# Altium schematic sheet FDDplus3.SchDoc
size A2; Organization: HOME; Address1: L3, 12a Rodborough Rd; Address2: Frenchs Forest; Address3: NSW; Address4: Australia 2086; PageSetup: Record=PageOptions|CenterHorizontal=True|CenterVertical=True|PrintScale=0.52|XCorrection=1.00|YCorrection=1.00|PrintKind=0|BorderSize=5000000|LeftOffset=0|BottomOffset=0|Orientation=2|PaperLength=1000|PaperWidth=1000|Scale=100|PaperSource=7|PrintQuality=-3|MediaType=1|DitherType=10|PrintScaleMode=1|PaperKind=A4|PaperIndex=9
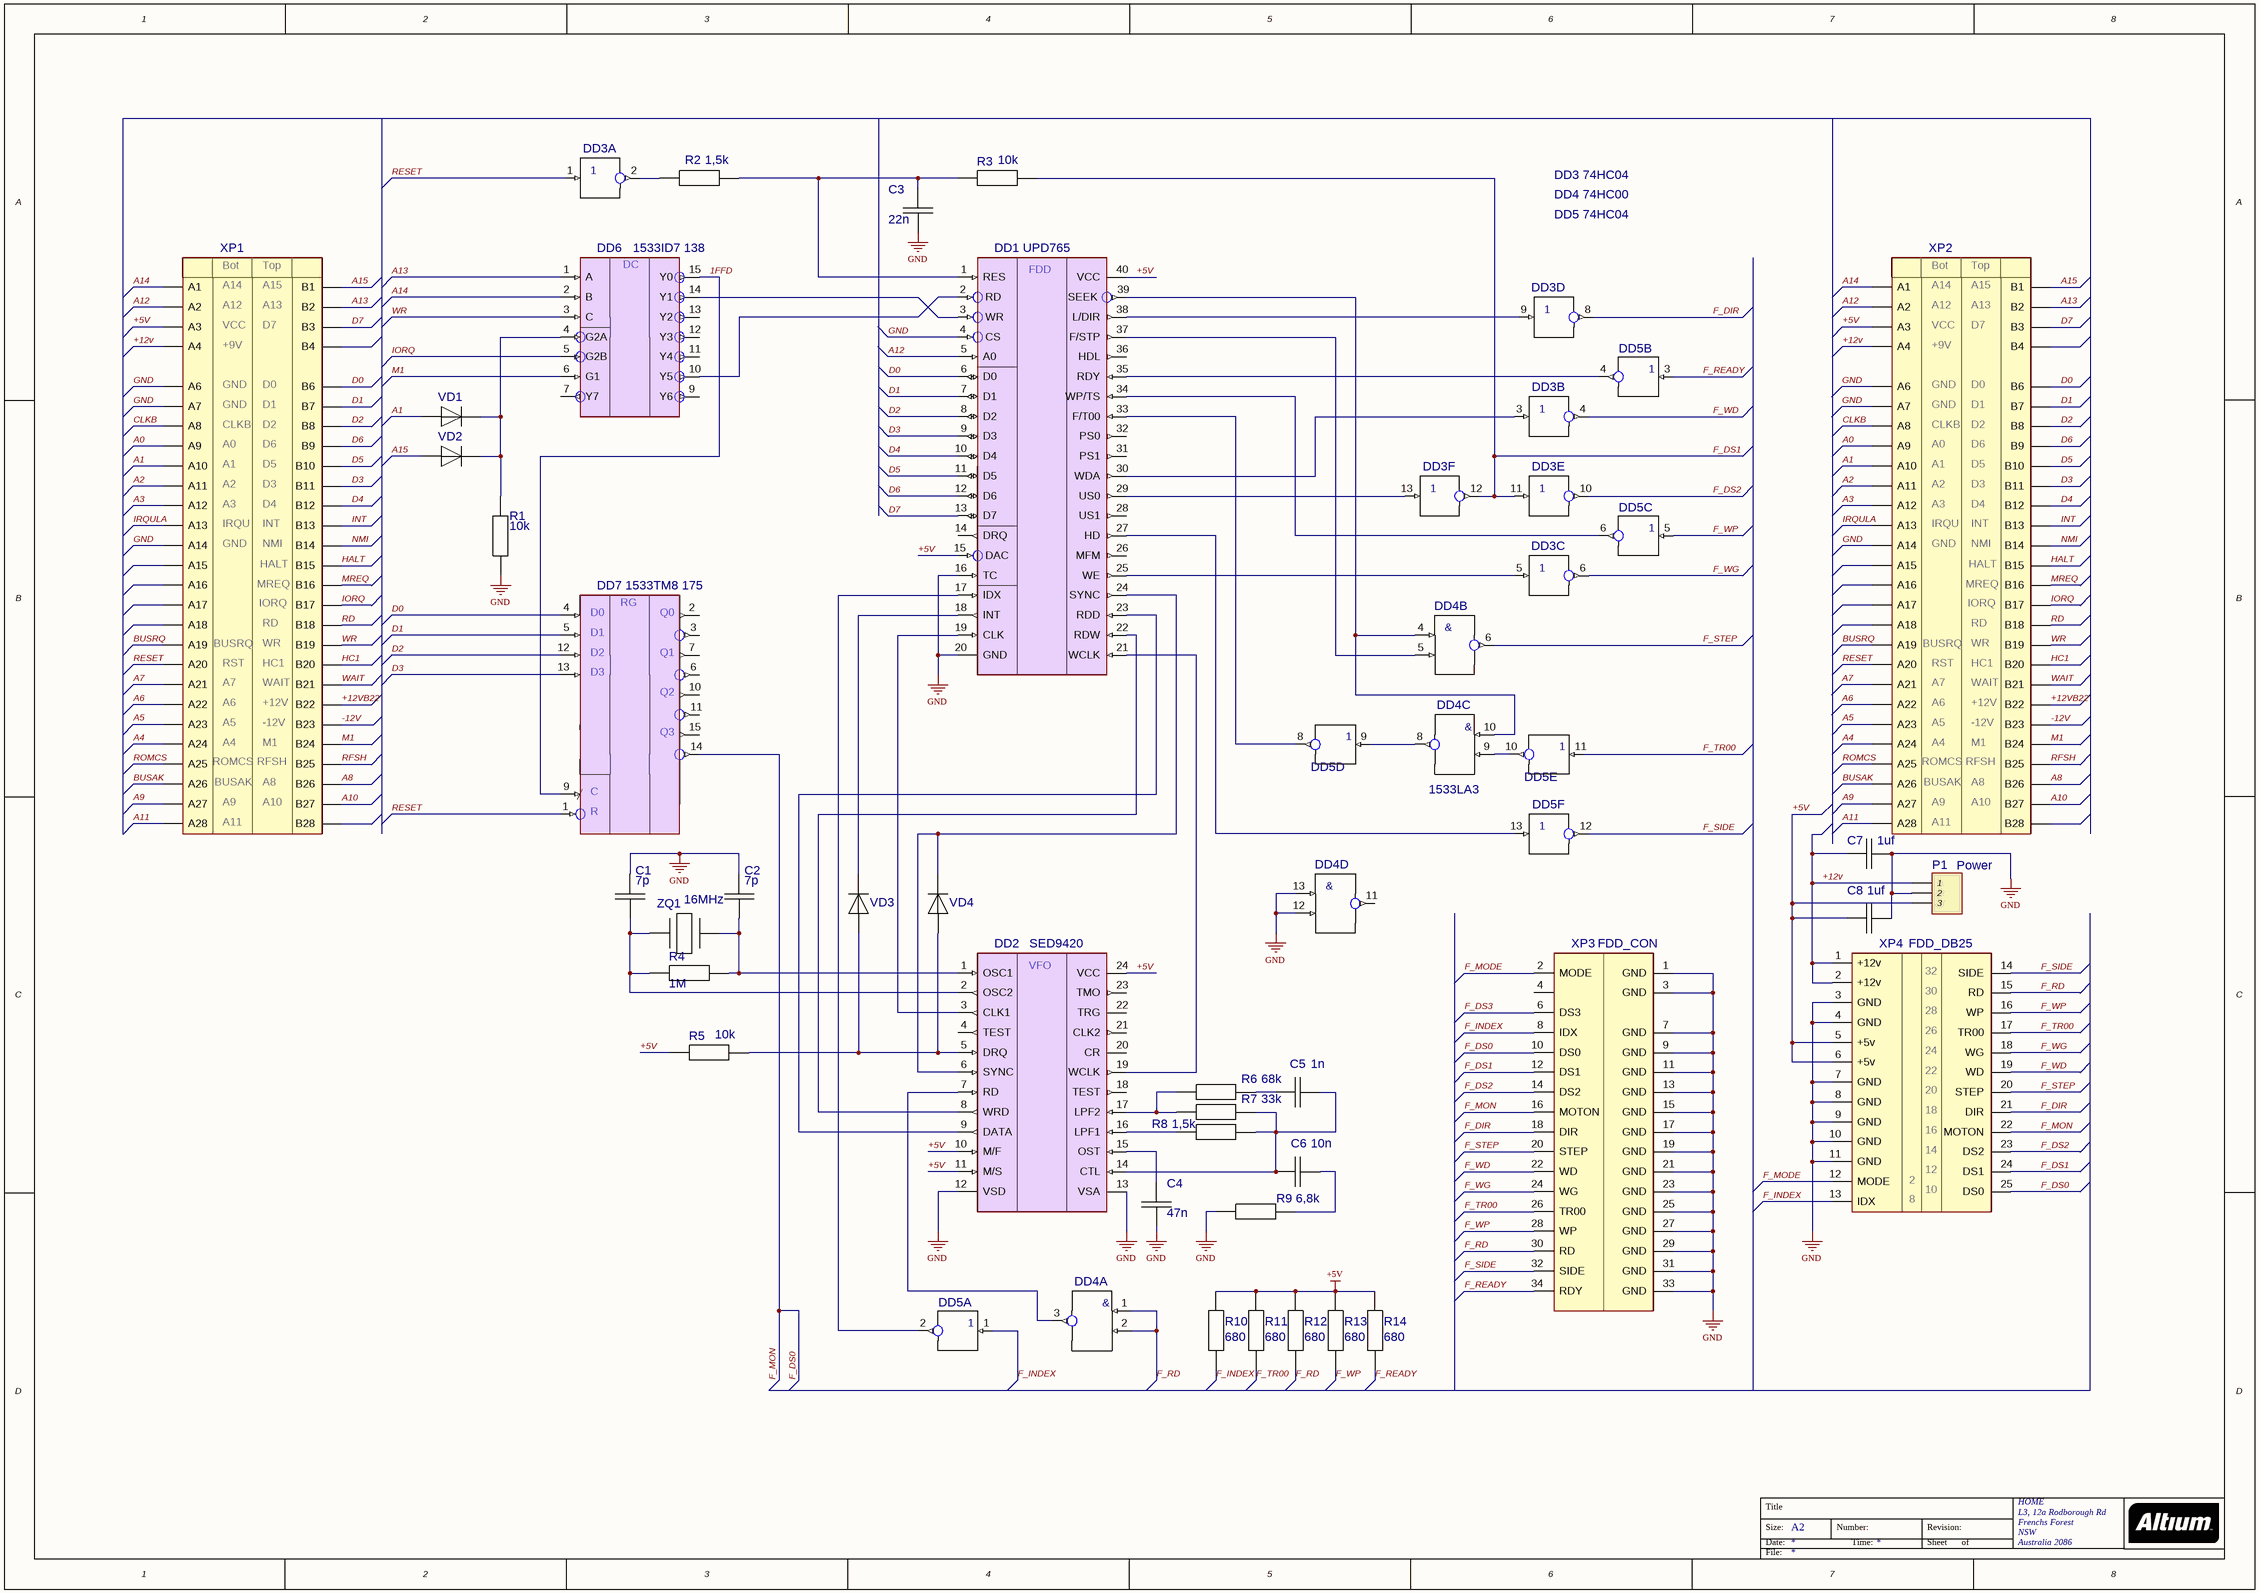
[diagram p0: FDDplus3.SchDoc]

## Parts
C1  value 7p  [K10-17_75]  (hidden comment: K10-17_75)
C2  value 7p  [K10-17_75]  (hidden comment: K10-17_75)
C3  value 22n  [K10-17_75]  (hidden comment: K10-17_75)
C4  value 47n  [K10-17_75]  (hidden comment: K10-17_75)
C5  value 1n  [K10-17_75]  (hidden comment: K10-17_75)
C6  value 10n  [K10-17_75]  (hidden comment: K10-17_75)
C7  value 1uf  [K10-17_75]  (hidden comment: K10-17_75)
C8  value 1uf  [K10-17_75]  (hidden comment: K10-17_75)
DD1  UPD765  [DIP40_15]
DD2  SED9420  [DIP24_15]
DD3  1533LN1  [DIP14]  (value not drawn)  (parts A,B,C,D,E,F of 6)
DD4  1533LA3  [DIP14]  (value not drawn)  (parts A,B,C,D of 4)
DD5  1533LN1  [DIP14]  (value not drawn)  (parts A,B,C,D,E,F of 6)
DD6  1533ID7 138  [DIP16]
DD7  1533TM8 175  [DIP16]
P1  Power  [HDR1X3]
R1  value 10k  [R0125-2_5]  (hidden comment: R0125-2_5)
R2  value 1,5k  [R0125-2_5]  (hidden comment: R0125-2_5)
R3  value 10k  [R0125-2_5]  (hidden comment: R0125-2_5)
R4  value 1M  [R0125-2_5]  (hidden comment: R0125-2_5)
R5  value 10k  [R0125-2_5]  (hidden comment: R0125-2_5)
R6  value 68k  [R0125-2_5]  (hidden comment: R0125-2_5)
R7  value 33k  [R0125-2_5]  (hidden comment: R0125-2_5)
R8  value 1,5k  [R0125-2_5]  (hidden comment: R0125-2_5)
R9  value 6,8k  [R0125-2_5]  (hidden comment: R0125-2_5)
R10  value 680  [R0125-2_5]  (hidden comment: R0125-2_5)
R11  value 680  [R0125-2_5]  (hidden comment: R0125-2_5)
R12  value 680  [R0125-2_5]  (hidden comment: R0125-2_5)
R13  value 680  [R0125-2_5]  (hidden comment: R0125-2_5)
R14  value 680  [R0125-2_5]  (hidden comment: R0125-2_5)
VD1  KD522-2_5  [KD522-2_5]  (value not drawn)
VD2  KD522-2_5  [KD522-2_5]  (value not drawn)
VD3  KD522-2_5  [KD522-2_5]  (value not drawn)
VD4  KD522-2_5  [KD522-2_5]  (value not drawn)
XP1  ZX EDGE  [ZX_EDGE]  (value not drawn)
XP2  ZX EDGE  [ZX_EDGE]  (value not drawn)
XP3  FDD_CON  [FDD_CON_Male]
XP4  FDD_DB25  [DSUB1.385-2H25A]
ZQ1  value 16MHz  [RK169MD]  (hidden comment: RK169MD)

## Nets
+5V: C8.2(B) DD1.15(DAC) DD1.40(VCC) DD2.10(M/F) DD2.11(M/S) DD2.24(VCC) DD3.14(+5V) DD4.14(+5V) DD5.14(+5V) DD6.16(+5V) DD7.16(+5V) P1.3 R5.2(B) R10.1(A) R11.1(A) R12.1(A) R13.1(A) R14.1(A) XP1.3(A3) XP2.3(A3) XP4.5(+5v) XP4.6(+5v)
GND: C1.2(B) C2.2(B) C3.1(A) C4.1(A) C7.1(A) C8.1(A) DD1.4(CS) DD1.16(TC) DD1.20(GND) DD2.12(VSD) DD2.13(VSA) DD3.7(GND) DD4.7(GND) DD4.12(B) DD4.13(A) DD5.7(GND) DD6.8(GND) DD7.8(GND) P1.2 R1.1(A) R9.2(B) XP1.6(A6) XP1.7(A7) XP1.14(A14) XP2.6(A6) XP2.7(A7) XP2.14(A14) XP3.1(GND) XP3.3(GND) XP3.7(GND) XP3.9(GND) XP3.11(GND) XP3.13(GND) XP3.15(GND) XP3.17(GND) XP3.19(GND) XP3.21(GND) XP3.23(GND) XP3.25(GND) XP3.27(GND) XP3.29(GND) XP3.31(GND) XP3.33(GND) XP4.3(GND) XP4.4(GND) XP4.7(GND) XP4.8(GND) XP4.9(GND) XP4.10(GND) XP4.11(GND)
1FFD: DD6.15(Y0) DD7.9(C)
+12v: C7.2(B) P1.1 XP1.4(A4) XP2.4(A4) XP4.1(+12v) XP4.2(+12v)
+12VB22: XP1.50(B22) XP2.50(B22)
-12V: XP1.51(B23) XP2.51(B23)
A0: XP1.9(A9) XP2.9(A9)
A1: VD1.1(A) XP1.10(A10) XP2.10(A10)
A2: XP1.11(A11) XP2.11(A11)
A3: XP1.12(A12) XP2.12(A12)
A4: XP1.24(A24) XP2.24(A24)
A5: XP1.23(A23) XP2.23(A23)
A6: XP1.22(A22) XP2.22(A22)
A7: XP1.21(A21) XP2.21(A21)
A8: XP1.54(B26) XP2.54(B26)
A9: XP1.27(A27) XP2.27(A27)
A10: XP1.55(B27) XP2.55(B27)
A11: XP1.28(A28) XP2.28(A28)
A12: DD1.5(A0) XP1.2(A2) XP2.2(A2)
A13: DD6.1(A) XP1.30(B2) XP2.30(B2)
A14: DD6.2(B) XP1.1(A1) XP2.1(A1)
A15: VD2.1(A) XP1.29(B1) XP2.29(B1)
BUSAK: XP1.26(A26) XP2.26(A26)
BUSRQ: XP1.19(A19) XP2.19(A19)
CLKB: XP1.8(A8) XP2.8(A8)
D0: DD1.6(D0) DD7.4(D0) XP1.34(B6) XP2.34(B6)
D1: DD1.7(D1) DD7.5(D1) XP1.35(B7) XP2.35(B7)
D2: DD1.8(D2) DD7.12(D2) XP1.36(B8) XP2.36(B8)
D3: DD1.9(D3) DD7.13(D3) XP1.39(B11) XP2.39(B11)
D4: DD1.10(D4) XP1.40(B12) XP2.40(B12)
D5: DD1.11(D5) XP1.38(B10) XP2.38(B10)
D6: DD1.12(D6) XP1.37(B9) XP2.37(B9)
D7: DD1.13(D7) XP1.31(B3) XP2.31(B3)
F_DIR: DD3.8(B) XP3.18(DIR) XP4.21(DIR)
F_DS0: DD7.14(Q4/) XP3.10(DS0) XP3.16(MOTON) XP4.22(MOTON) XP4.25(DS0)  [also labelled F_MON]
F_DS1: DD3.11(A) DD3.12(B) R3.1(A) XP3.12(DS1) XP4.24(DS1)
F_DS2: DD3.10(B) XP3.14(DS2) XP4.23(DS2)
F_DS3: XP3.6(DS3)
F_INDEX: DD5.1(A) R10.2(B) XP3.8(IDX) XP4.13(IDX)
F_MODE: XP3.2(MODE) XP4.12(MODE)
F_RD: DD4.1(A) DD4.2(B) R12.2(B) XP3.30(RD) XP4.15(RD)
F_READY: DD5.3(A) R14.2(B) XP3.34(RDY)
F_SIDE: DD5.12(B) XP3.32(SIDE) XP4.14(SIDE)
F_STEP: DD4.6(C) XP3.20(STEP) XP4.20(STEP)
F_TR00: DD5.11(A) R11.2(B) XP3.26(TR00) XP4.17(TR00)
F_WD: DD3.4(B) XP3.22(WD) XP4.19(WD)
F_WG: DD3.6(B) XP3.24(WG) XP4.18(WG)
F_WP: DD5.5(A) R13.2(B) XP3.28(WP) XP4.16(WP)
HALT: XP1.43(B15) XP2.43(B15)
HC1: XP1.48(B20) XP2.48(B20)
INT: XP1.41(B13) XP2.41(B13)
IORQ: DD6.5(G2B) XP1.45(B17) XP2.45(B17)
IRQULA: XP1.13(A13) XP2.13(A13)
M1: DD6.6(G1) XP1.52(B24) XP2.52(B24)
MREQ: XP1.44(B16) XP2.44(B16)
NMI: XP1.42(B14) XP2.42(B14)
RD: XP1.46(B18) XP2.46(B18)
RESET: DD3.1(A) DD7.1(R) XP1.20(A20) XP2.20(A20)
RFSH: XP1.53(B25) XP2.53(B25)
ROMCS: XP1.25(A25) XP2.25(A25)
WAIT: XP1.49(B21) XP2.49(B21)
WR: DD6.3(C) XP1.47(B19) XP2.47(B19)
NetC1_1: C1.1(A) DD2.2(OSC2) R4.2(B) ZQ1.1(A)
NetC2_1: C2.1(A) DD2.1(OSC1) R4.1(A) ZQ1.2(B)
NetC3_2: C3.2(B) DD1.1(RES) R2.1(A) R3.2(B)
NetC4_2: C4.2(B) DD2.15(OST)
NetC5_1: C5.1(A) C6.2(B) DD2.14(CTL) R7.1(A) R8.1(A)
NetC5_2: C5.2(B) R6.1(A)
NetC6_1: C6.1(A) R9.1(A)
NetDD1_2: DD1.2(RD) DD6.10(Y5)
NetDD1_3: DD1.3(WR) DD6.14(Y1)
NetDD1_17: DD1.17(IDX) DD5.2(B)
NetDD1_18: DD1.18(INT) VD3.2(B)
NetDD1_19: DD1.19(CLK) DD2.3(CLK1)
NetDD1_21: DD1.21(WCLK) DD2.19(WCLK)
NetDD1_22: DD1.22(RDW) DD2.8(WRD)
NetDD1_23: DD1.23(RDD) DD2.9(DATA)
NetDD1_24: DD1.24(SYNC) DD2.6(SYNC) VD4.2(B)
NetDD1_25: DD1.25(WE) DD3.5(A)
NetDD1_27: DD1.27(HD) DD5.13(A)
NetDD1_29: DD1.29(US0) DD3.13(A)
NetDD1_30: DD1.30(WDA) DD3.3(A)
NetDD1_33: DD1.33(F/T00) DD5.8(B)
NetDD1_34: DD1.34(WP/TS) DD5.6(B)
NetDD1_35: DD1.35(RDY) DD5.4(B)
NetDD1_37: DD1.37(F/STP) DD4.5(B)
NetDD1_38: DD1.38(L/DIR) DD3.9(A)
NetDD1_39: DD1.39(SEEK) DD4.4(A) DD4.10(A)
NetDD2_5: DD2.5(DRQ) R5.1(A) VD3.1(A) VD4.1(A)
NetDD2_7: DD2.7(RD) DD4.3(C)
NetDD2_16: DD2.16(LPF1) R8.2(B)
NetDD2_17: DD2.17(LPF2) R6.2(B) R7.2(B)
NetDD3_2: DD3.2(B) R2.2(B)
NetDD4_8: DD4.8(C) DD5.9(A)
NetDD4_9: DD4.9(B) DD5.10(B)
NetDD6_4: DD6.4(G2A) R1.2(B) VD1.2(B) VD2.2(B)

Not connected (* = marked no-connect by the designer): DD1 14(DRQ) 26(MFM) 28(US1) 31(PS1) 32(PS0) 36(HDL); DD2 4(TEST) 18(TEST) 20(CR) 21(CLK2) 22(TRG) 23(TMO); DD4 11(C); DD6 7(Y7) 9(Y6) 11(Y4) 12(Y3) 13(Y2); DD7 2(Q0) 3(Q0/) 6(Q1/) 7(Q1) 10(Q2) 11(Q2/) 15(Q4); XP1 15(A15) 16(A16) 17(A17) 18(A18) 32(B4) 56(B28); XP2 15(A15) 16(A16) 17(A17) 18(A18) 32(B4) 56(B28); XP3 4; XP4 26 27 28 29 30 31 32 33 34 35 36 37 38 39 40 41 42 43 44 45 46 47 48 49 50

## Notes on the sheet
- DD3 74HC04
- DD4 74HC00
- DD5 74HC04
- Title
- Size:
- Date:
- File:
- A2
- Number:
- Time:
- Revision:
- Sheet
- of
- (in symbol 1533ID7) DC
- (in symbol 1533LA3, part A) &
- (in symbol 1533LA3, part B) &
- (in symbol 1533LA3, part C) &
- (in symbol 1533LA3, part D) &
- (in symbol 1533TM8) RG; Q3
- (in symbol SED9420) VFO
- (in symbol UPD765) FDD
- (in symbol ZX EDGE) Bot; Top; VCC; D7; +9V; GND; D0; D1; CLKB; D2; A0; D6; D5; D3; D4; IRQU; INT; NMI; HALT; MREQ; IORQ; RD; BUSRQ; WR; RST; HC1; WAIT; +12V; A5; -12V; M1; ROMCS; RFSH; BUSAK

## Library data of the parts
DD6 = 1533ID7: Value: *
DD7 = 1533TM8: Value: *
P1 = Header 3: Header, 3-Pin; LatestRevisionDate: 17-Jul-2002; LatestRevisionNote: Re-released for DXP Platform.; Publisher: Altium Limited
DD1 = UPD765: Value: *
DD2 = SED9420: Value: *
DD3 DD5 = 1533LN1: Value: *
DD4 = 1533LA3: Value: *
VD1-VD4 = KD522-2_5: Value: *
XP1 XP2 = ZX EDGE: Value: *
XP3 = FDD_CON: Value: *
XP4 = FDD_DB25: Value: *